# EAGLE design 00A-100 (EAGLE 9.6.2)
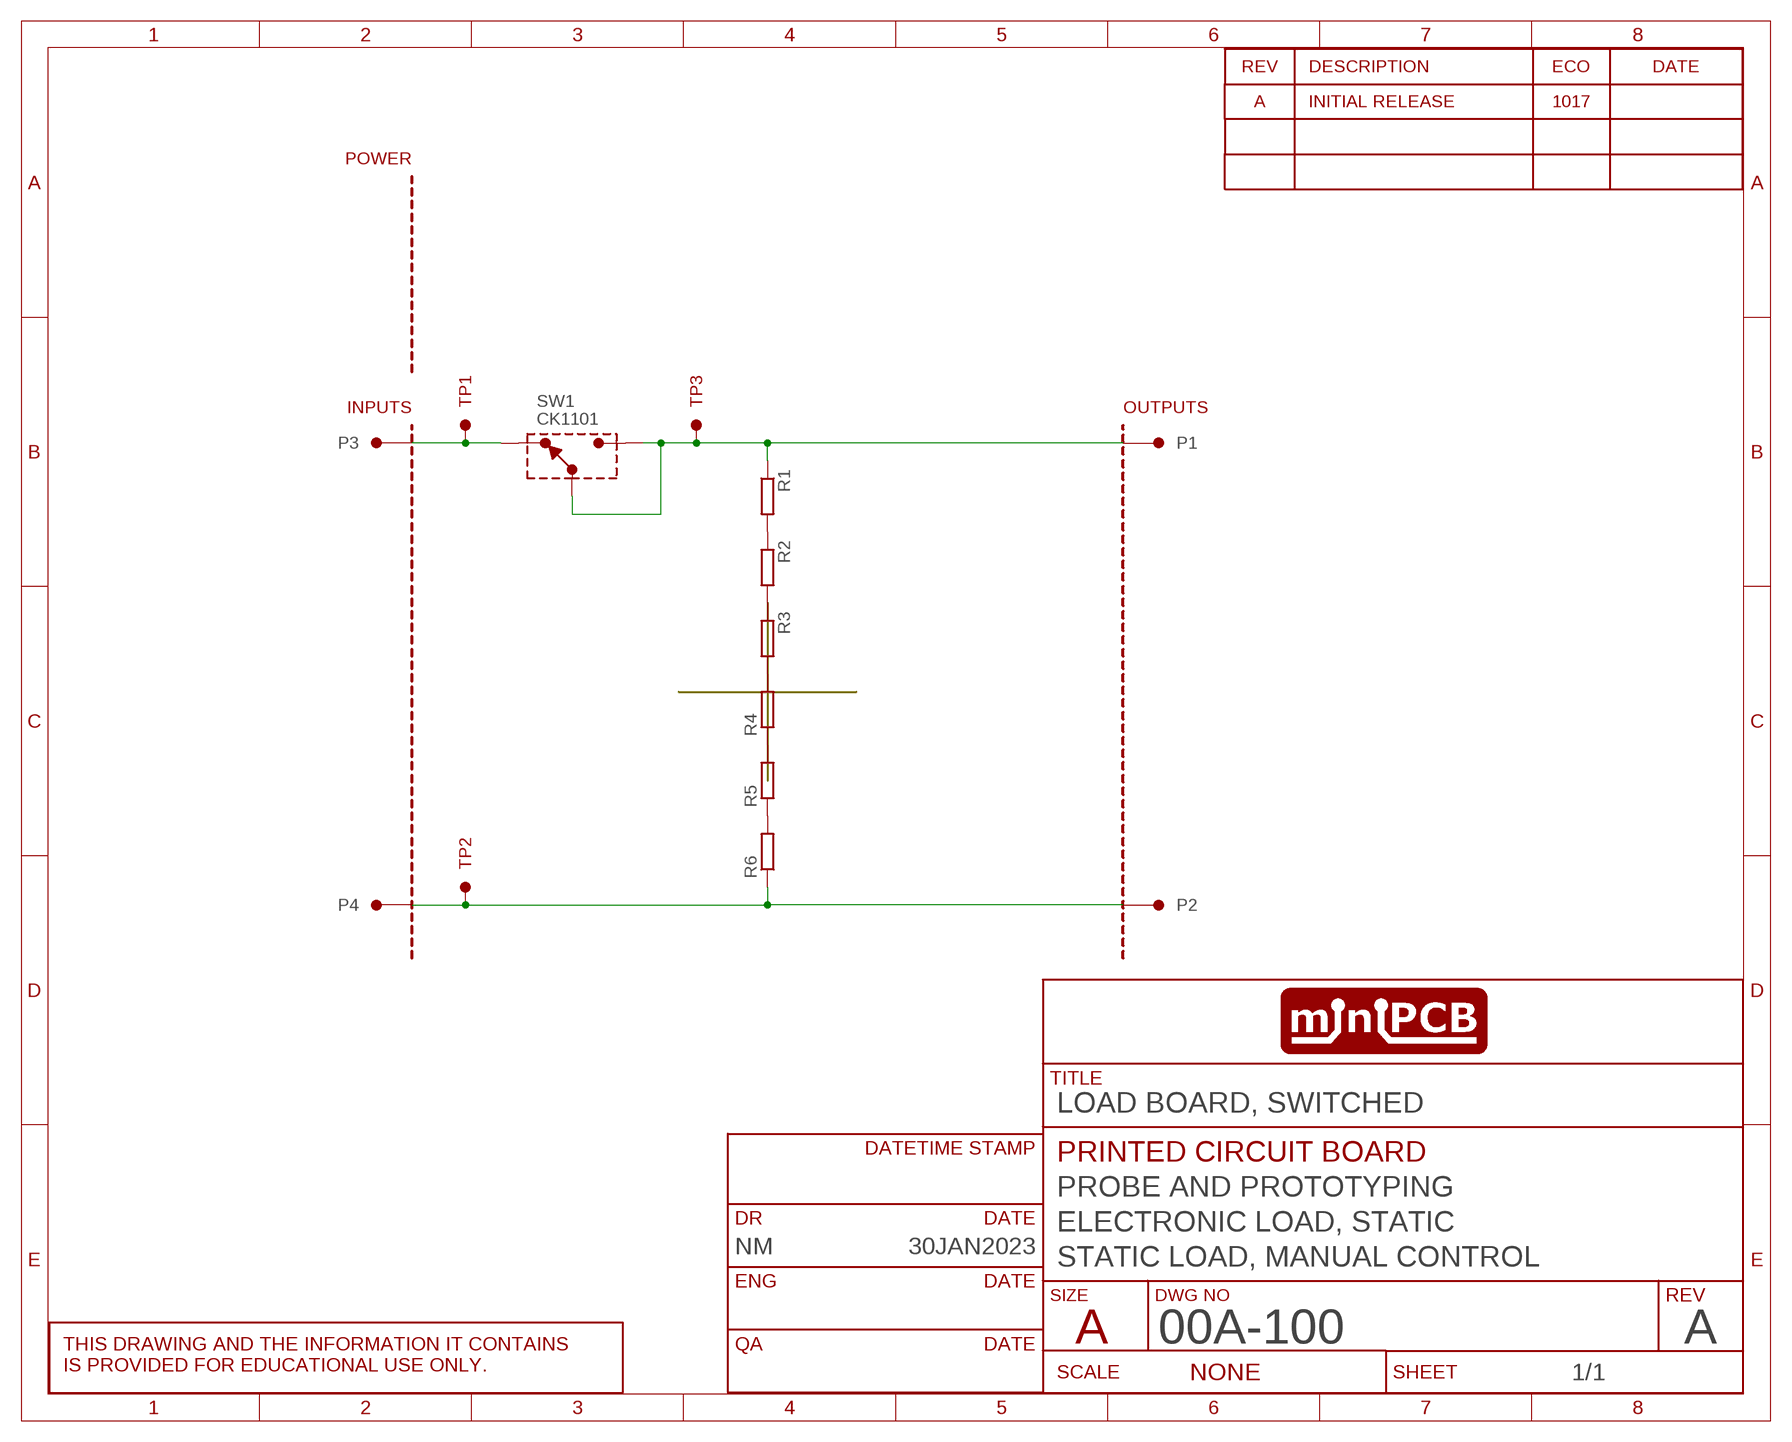
[diagram p0: schematic, sheet 1]
SHEET1 (SCHEMATIC): CIRCUIT_CATEGORY: PROBE AND PROTOTYPING; CIRCUIT_NAME: ELECTRONIC LOAD, STATIC; CIRCUIT_VARIANT: STATIC LOAD, MANUAL CONTROL; DR: NM; DR_DATE: 30JAN2023; PCB_PCBA: PRINTED CIRCUIT BOARD; REVA: A; REVA_ECO: 1017; REVISION: A; TITLE: LOAD BOARD, SWITCHED

## Parts
P1  PINS_1KE6060  [PINS_1_KE6060]
P2  PINS_1KE6060  [PINS_1_KE6060]
P3  PINS_15699-0  [BANANAPOST]
P4  PINS_15699-0  [BANANAPOST]
PCB1  MINIPCB_0P50X50  [MINIPCB_0P_50X50MM]
R1  RESISTOR15MM  [R-THD-15MM]
R2  RESISTOR15MM  [R-THD-15MM]
R3  RESISTOR15MM  [R-THD-15MM]
R4  RESISTOR15MM  [R-THD-15MM]
R5  RESISTOR15MM  [R-THD-15MM]
R6  RESISTOR15MM  [R-THD-15MM]
SW1  CK1101  SPDTM2S3CQE2  [CK1101]
TP1  TESTPOINTKE5100  [PINS_1_TESTPOINT_KE5100]
TP2  TESTPOINTKE5100  [PINS_1_TESTPOINT_KE5100]
TP3  TESTPOINTKE5100  [PINS_1_TESTPOINT_KE5100]

## Nets
N$1: P1.1 P1.2 R1.1 SW1.P$2 SW1.P$3 TP3.1
N$2: P2.1 P2.2 P4.1 R6.1 TP2.1
N$3: R1.2 R2.1
N$4: R2.2 R3.1
N$5: P3.1 SW1.P$1 TP1.1
N$6: R3.2 R4.2
N$7: R4.1 R5.2
N$8: R5.1 R6.2

## Library data of the parts
P1-P4 = minipcb:PINS_1
PCB1 = minipcb:MINIPCB_0P; PART_NUMBER: 00A-100-A; REVISION: A
R1-R6 = minipcb:RESISTOR
SW1 = minipcb:SPDT
TP1-TP3 = minipcb:TESTPOINT

## Board
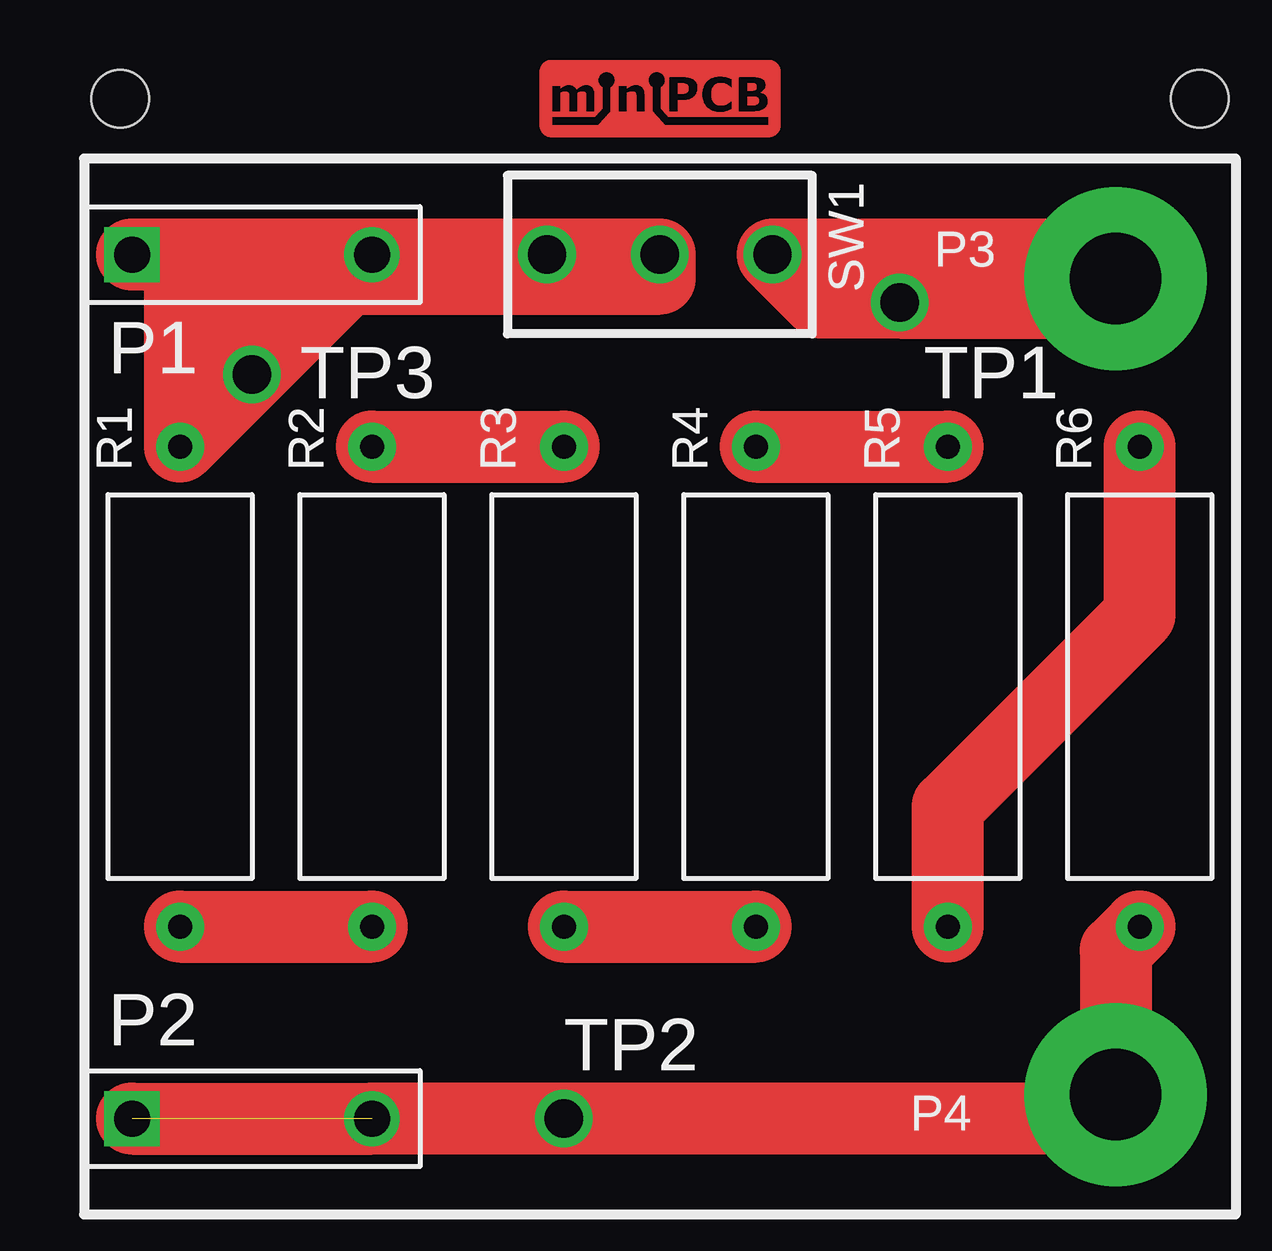
[diagram p1: board, top side]
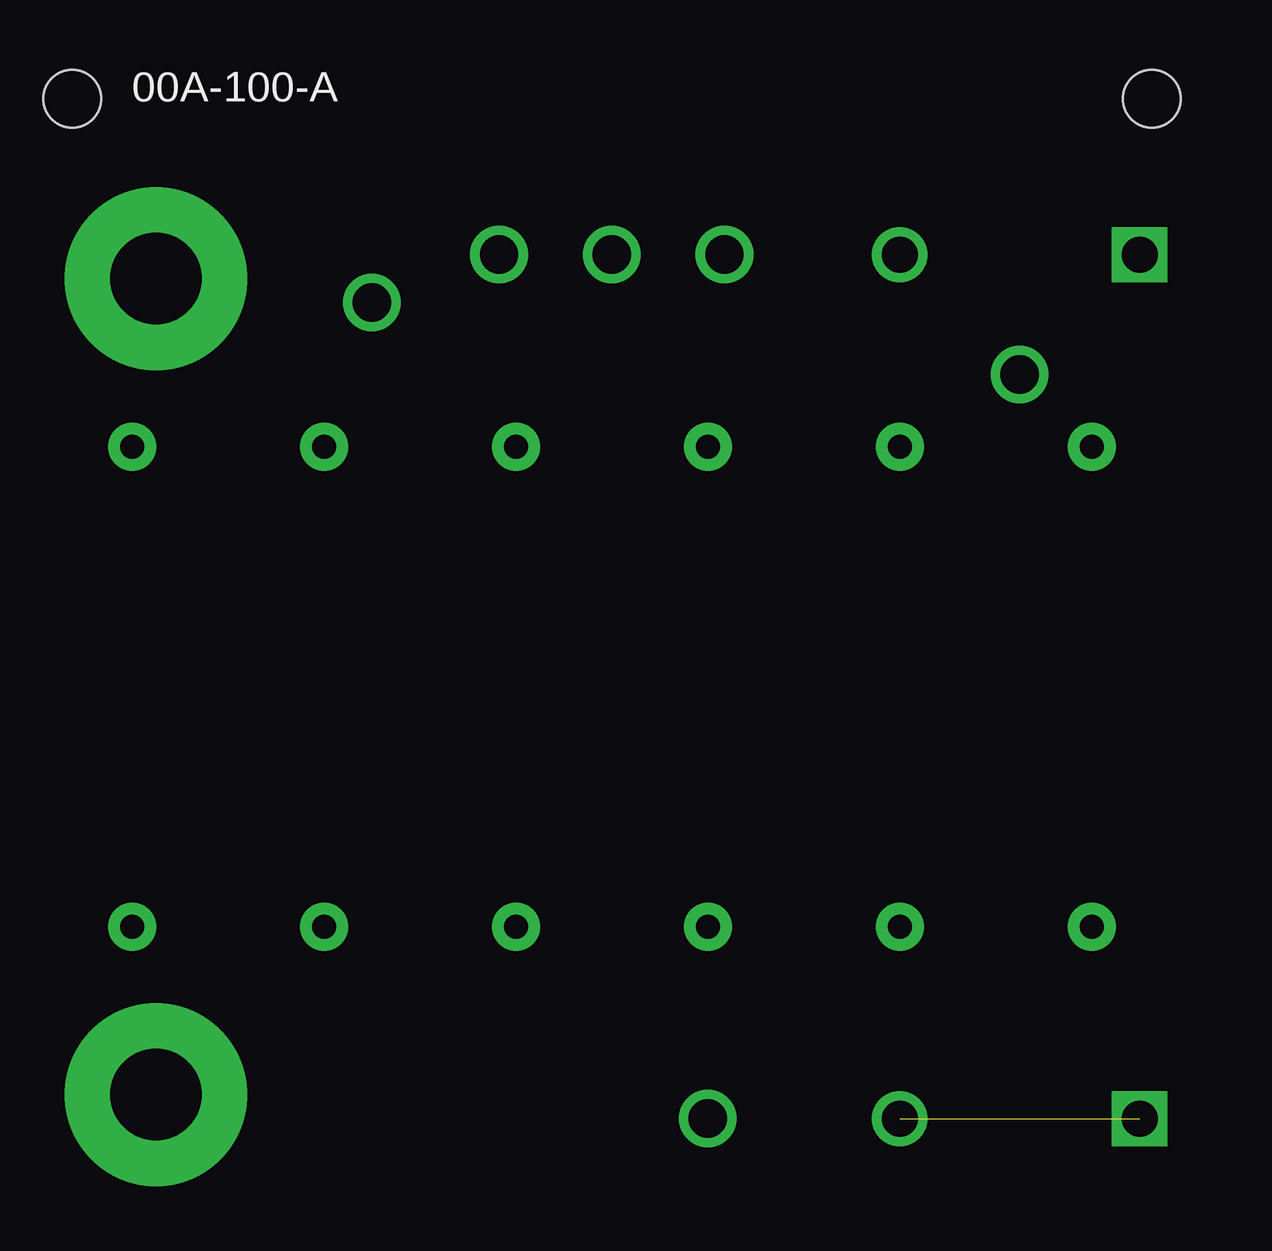
[diagram p2: board, bottom side, seen from below]

No outline drawn. Coordinates in mm, seen from the top.
Copper layers (1*16): Top 0.035mm / dielectric 1.5mm / Bottom 0.035mm
Design rules "minipcb": minimum track width 0.2mm, minimum drill 0.5mm, track to track 0.25mm, track to pad 0.5mm, pad to pad 0.5mm, via to via 0.5mm, smd to smd 0.15mm, copper to edge 1mm, drill to drill 1mm, minimum pad ring 0.4mm, minimum via ring 0.4mm, stop-mask expansion 0.1mm, vias tented up to drill 0.6mm, thermal gap 0.5mm

### Footprints (pad centres in the part's own frame; a part is rotated, then mirrored left to right if it is on the bottom)
PINS_1_KE6060 = drill 1.5 square: 1 -5,0 | drill 1.5: 2 5,0
BANANAPOST = drill 3.81 pad 7.62: 1 0,0
MINIPCB_0P_50X50MM = hole 2.4: 47.5,47.5; 2.5,47.5
R-THD-15MM = drill 1 pad 2: 1 -10,0; 2 10,0
CK1101 = drill 1.6: P$1 0,4.699; P$2 0,0; P$3 0,-4.699
PINS_1_TESTPOINT_KE5100 = drill 1.6: 1 0,0

### Placement (x,y rotation side)
P1  8,41 0 top
P2  8,5 0 top
P3  44,40 0 top
P4  44,6 0 top
PCB1  0,0 0 top
R1  5,23 270 top
R2  13,23 90 top
R3  21,23 270 top
R4  29,23 270 top
R5  37,23 90 top
R6  45,23 90 top
SW1  25,41 270 top
TP1  35,39 0 top
TP2  21,5 0 top
TP3  8,36 0 top

### Tracks (layer width: path | path; a pad name or v marks a point on that pad's centre or on a via)
N$1
  Top 3: P1.2 SW1.P$3 SW1.P$2 25,40 5,40 R1.1 TP3.1 | P1.2 P1.1 | TP3.1 8,39 | TP3.1 P1.2
N$2  (1 unrouted)
  Top 3: P2.1 P2.2 43,5 P4.1 44,12 R6.1
N$3
  Top 3: R1.2 R2.1
N$4
  Top 3: R2.2 R3.1
N$5
  Top 3: P3.1 43,40 42,41 SW1.P$1 31.7,39 TP1.1 43,39 P3.1
N$6
  Top 3: R3.2 R4.2
N$7
  Top 3: R4.1 R5.2
N$8
  Top 3: R5.1 37,18 45,26 R6.2

### Text on the board
_tNames: SW1 | P3 | P1 | TP3 | TP1 | R1 | R2 | R3 | R4 | R5 | R6 | P2 | TP2 | P4